# EasyEDA Pro project PCB.epro, schematic 1_P1
Board Name: 1_P1; Create Date: 2026-06-26; Page Name: 1_P1; Project Name: opencalc; Schematic Name: 1_P1; Update Date: 2026-08-03
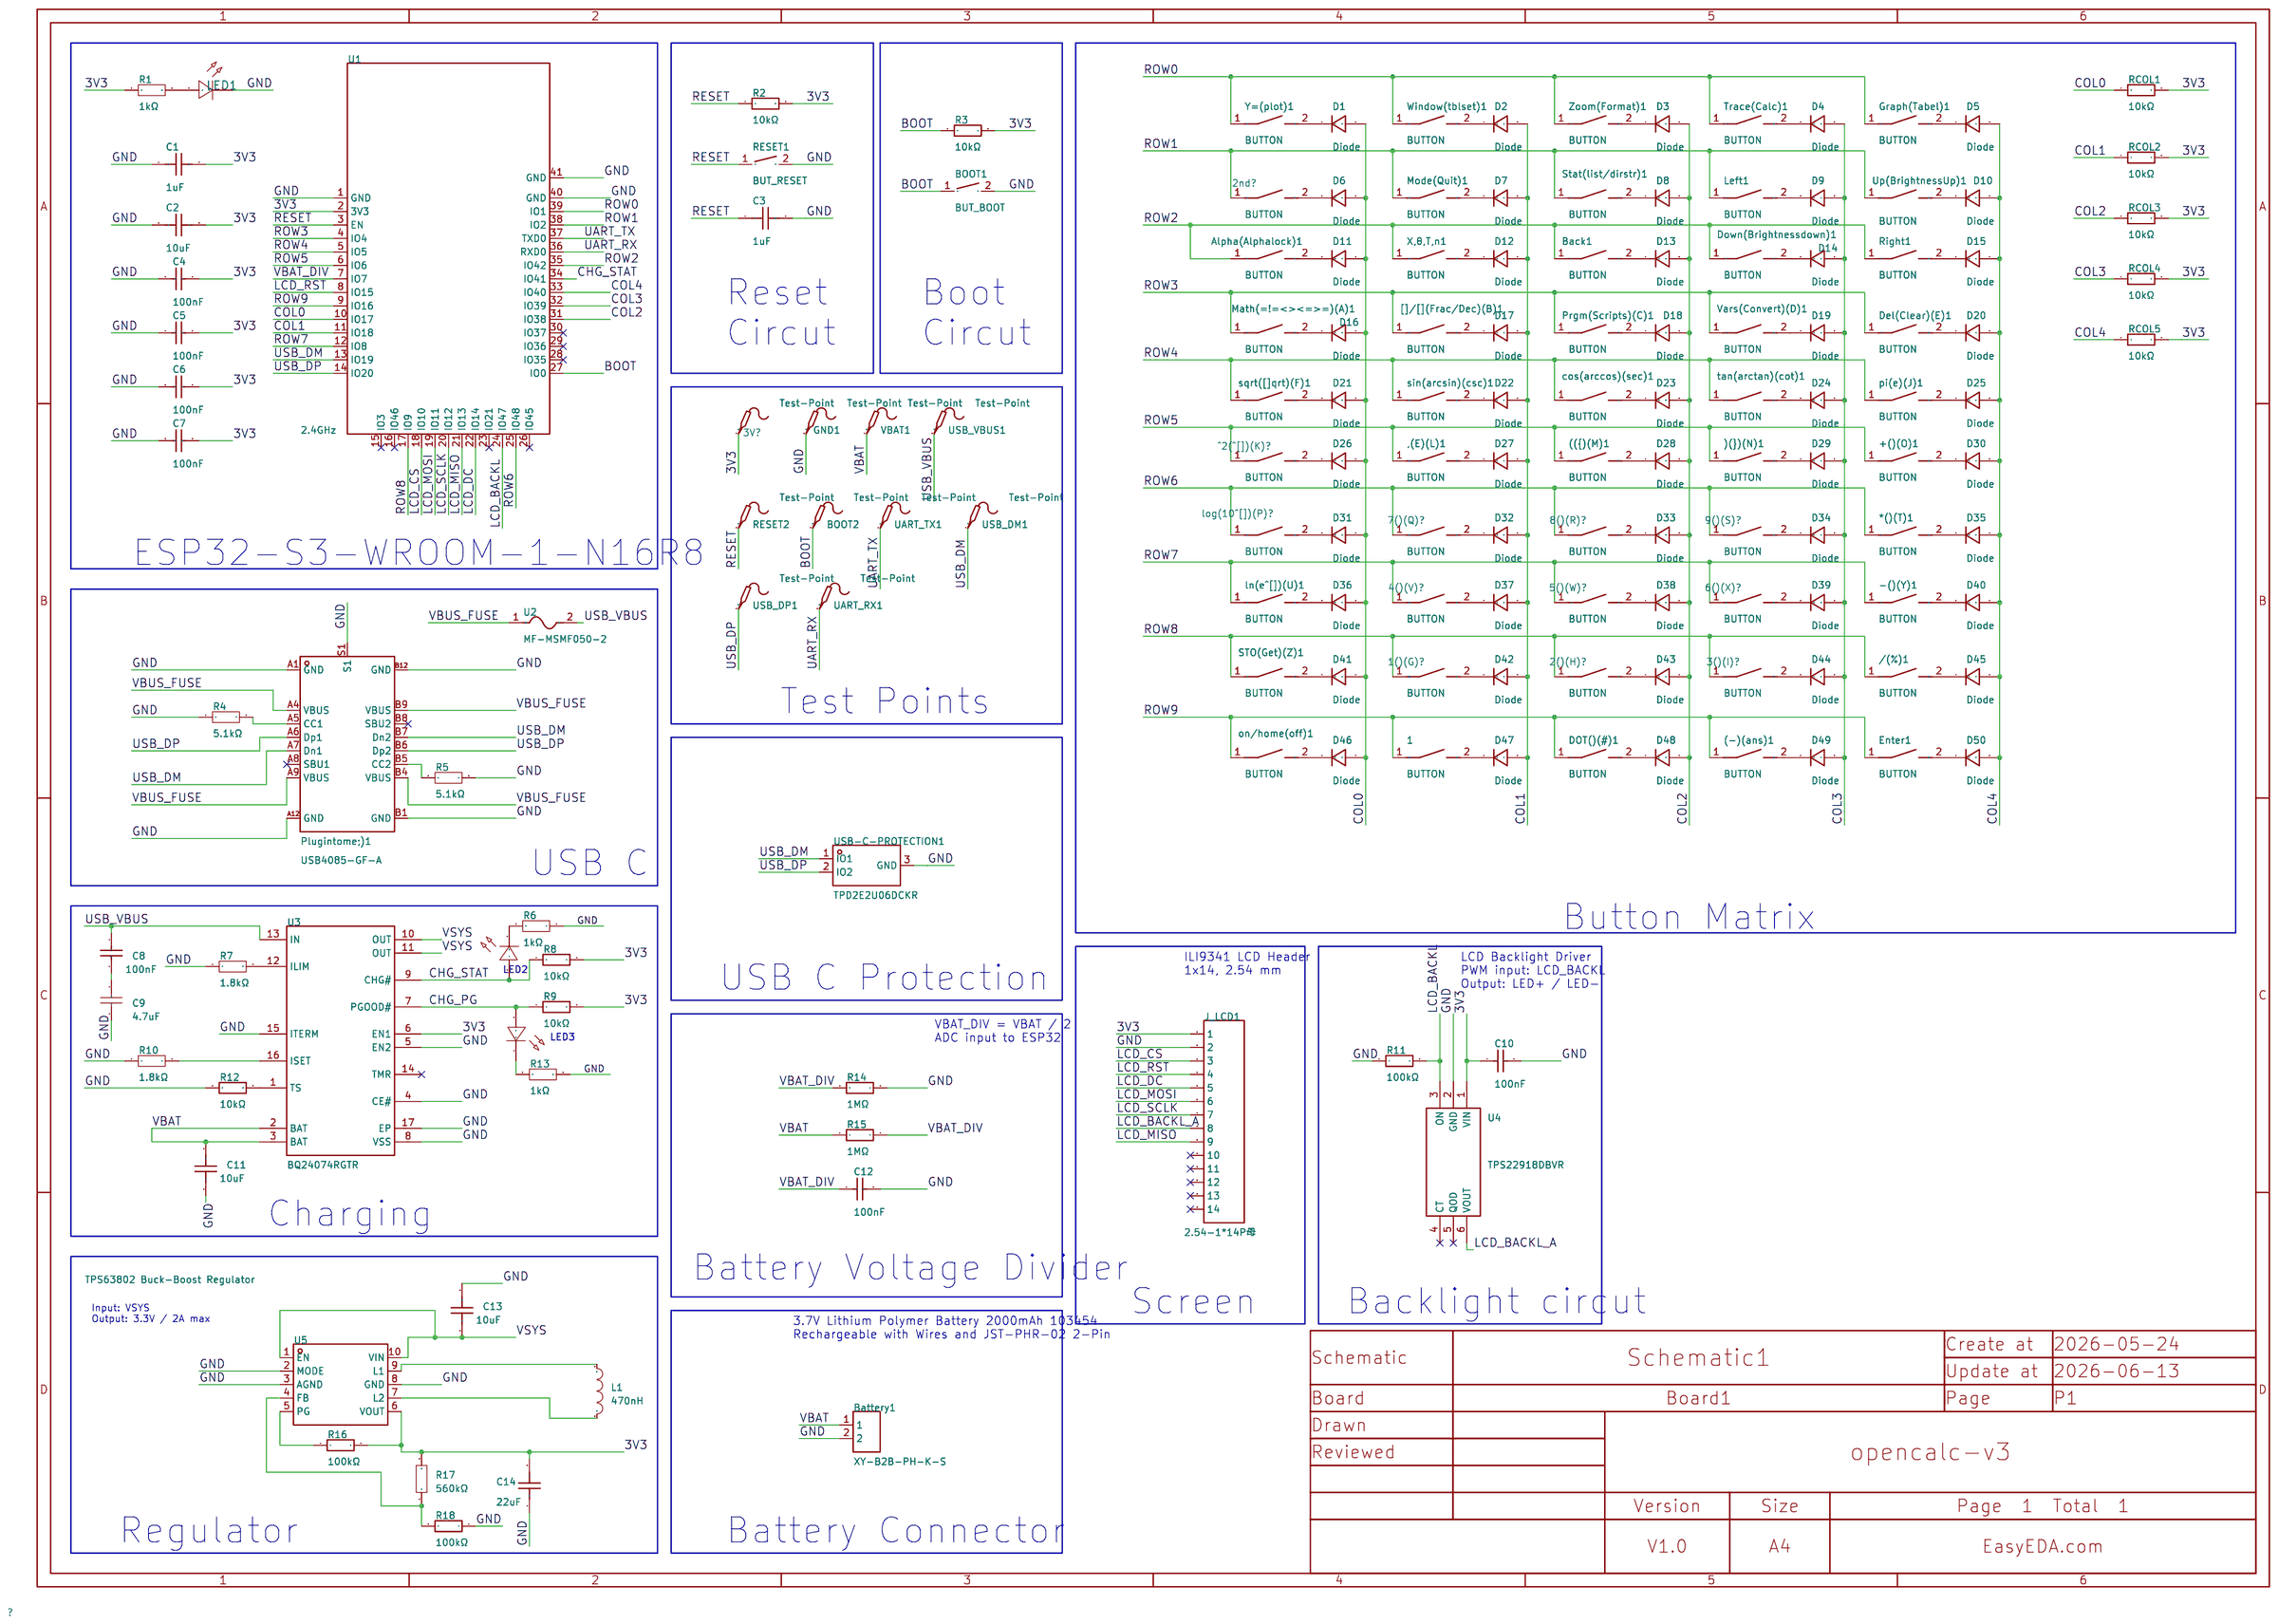
[diagram p0: schematic sheet]

## Parts
1  BUTTON  [KEY-SMD_L6.2-W3.6-LS8.0_K2-1107ST-A4SW-06]
1()(G)?#10  BUTTON  [KEY-SMD_L6.2-W3.6-LS8.0_K2-1107ST-A4SW-06]
2()(H)?#11  BUTTON  [KEY-SMD_L6.2-W3.6-LS8.0_K2-1107ST-A4SW-06]
2nd?#1  BUTTON  [KEY-SMD_L6.2-W3.6-LS8.0_K2-1107ST-A4SW-06]
3()(I)?#12  BUTTON  [KEY-SMD_L6.2-W3.6-LS8.0_K2-1107ST-A4SW-06]
3V?#13  Test-Point  [Test-Point-0.5mm]
4()(V)?#7  BUTTON  [KEY-SMD_L6.2-W3.6-LS8.0_K2-1107ST-A4SW-06]
5()(W)?#8  BUTTON  [KEY-SMD_L6.2-W3.6-LS8.0_K2-1107ST-A4SW-06]
6()(X)?#9  BUTTON  [KEY-SMD_L6.2-W3.6-LS8.0_K2-1107ST-A4SW-06]
7()(Q)?#4  BUTTON  [KEY-SMD_L6.2-W3.6-LS8.0_K2-1107ST-A4SW-06]
8()(R)?#5  BUTTON  [KEY-SMD_L6.2-W3.6-LS8.0_K2-1107ST-A4SW-06]
9()(S)?#6  BUTTON  [KEY-SMD_L6.2-W3.6-LS8.0_K2-1107ST-A4SW-06]
(({)(M)1  BUTTON  [KEY-SMD_L6.2-W3.6-LS8.0_K2-1107ST-A4SW-06]
(-)(ans)1  BUTTON  [KEY-SMD_L6.2-W3.6-LS8.0_K2-1107ST-A4SW-06]
)(})(N)1  BUTTON  [KEY-SMD_L6.2-W3.6-LS8.0_K2-1107ST-A4SW-06]
*()(T)1  BUTTON  [KEY-SMD_L6.2-W3.6-LS8.0_K2-1107ST-A4SW-06]
+()(O)1  BUTTON  [KEY-SMD_L6.2-W3.6-LS8.0_K2-1107ST-A4SW-06]
,(E)(L)1  BUTTON  [KEY-SMD_L6.2-W3.6-LS8.0_K2-1107ST-A4SW-06]
-()(Y)1  BUTTON  [KEY-SMD_L6.2-W3.6-LS8.0_K2-1107ST-A4SW-06]
/(%)1  BUTTON  [KEY-SMD_L6.2-W3.6-LS8.0_K2-1107ST-A4SW-06]
[]/[](Frac/Dec)(B)1  BUTTON  [KEY-SMD_L6.2-W3.6-LS8.0_K2-1107ST-A4SW-06]
^2(^[])(K)?#2  BUTTON  [KEY-SMD_L6.2-W3.6-LS8.0_K2-1107ST-A4SW-06]
Alpha(Alphalock)1  BUTTON  [KEY-SMD_L6.2-W3.6-LS8.0_K2-1107ST-A4SW-06]
Back1  BUTTON  [KEY-SMD_L6.2-W3.6-LS8.0_K2-1107ST-A4SW-06]
Battery1  XY-B2B-PH-K-S  [CONN-TH_B2B-PH-K-S]
BOOT1  BUT_BOOT  [KEY-SMD_L4.0-W3.0-LS4.9-1]
BOOT2  Test-Point  [Test-Point-0.5mm]
C1  1uF  [C0402]
C2  10uF  [C0805]
C3  1uF  [C0402]
C4  100nF  [C1206]
C5  100nF  [C1206]
C6  100nF  [C1206]
C7  100nF  [C1206]
C8  100nF  [C1206]
C9  4.7uF  [C0603]
C10  100nF  [C1206]
C11  10uF  [C0805]
C12  100nF  [C1206]
C13  10uF  [C0805]
C14  22uF  [C1206]
cos(arccos)(sec)1  BUTTON  [KEY-SMD_L6.2-W3.6-LS8.0_K2-1107ST-A4SW-06]
D1  Diode  [SOD-323_L1.8-W1.3-LS2.5-RD]
D2  Diode  [SOD-323_L1.8-W1.3-LS2.5-RD]
D3  Diode  [SOD-323_L1.8-W1.3-LS2.5-RD]
D4  Diode  [SOD-323_L1.8-W1.3-LS2.5-RD]
D5  Diode  [SOD-323_L1.8-W1.3-LS2.5-RD]
D6  Diode  [SOD-323_L1.8-W1.3-LS2.5-RD]
D7  Diode  [SOD-323_L1.8-W1.3-LS2.5-RD]
D8  Diode  [SOD-323_L1.8-W1.3-LS2.5-RD]
D9  Diode  [SOD-323_L1.8-W1.3-LS2.5-RD]
D10  Diode  [SOD-323_L1.8-W1.3-LS2.5-RD]
D11  Diode  [SOD-323_L1.8-W1.3-LS2.5-RD]
D12  Diode  [SOD-323_L1.8-W1.3-LS2.5-RD]
D13  Diode  [SOD-323_L1.8-W1.3-LS2.5-RD]
D14  Diode  [SOD-323_L1.8-W1.3-LS2.5-RD]
D15  Diode  [SOD-323_L1.8-W1.3-LS2.5-RD]
D16  Diode  [SOD-323_L1.8-W1.3-LS2.5-RD]
D17  Diode  [SOD-323_L1.8-W1.3-LS2.5-RD]
D18  Diode  [SOD-323_L1.8-W1.3-LS2.5-RD]
D19  Diode  [SOD-323_L1.8-W1.3-LS2.5-RD]
D20  Diode  [SOD-323_L1.8-W1.3-LS2.5-RD]
D21  Diode  [SOD-323_L1.8-W1.3-LS2.5-RD]
D22  Diode  [SOD-323_L1.8-W1.3-LS2.5-RD]
D23  Diode  [SOD-323_L1.8-W1.3-LS2.5-RD]
D24  Diode  [SOD-323_L1.8-W1.3-LS2.5-RD]
D25  Diode  [SOD-323_L1.8-W1.3-LS2.5-RD]
D26  Diode  [SOD-323_L1.8-W1.3-LS2.5-RD]
D27  Diode  [SOD-323_L1.8-W1.3-LS2.5-RD]
D28  Diode  [SOD-323_L1.8-W1.3-LS2.5-RD]
D29  Diode  [SOD-323_L1.8-W1.3-LS2.5-RD]
D30  Diode  [SOD-323_L1.8-W1.3-LS2.5-RD]
D31  Diode  [SOD-323_L1.8-W1.3-LS2.5-RD]
D32  Diode  [SOD-323_L1.8-W1.3-LS2.5-RD]
D33  Diode  [SOD-323_L1.8-W1.3-LS2.5-RD]
D34  Diode  [SOD-323_L1.8-W1.3-LS2.5-RD]
D35  Diode  [SOD-323_L1.8-W1.3-LS2.5-RD]
D36  Diode  [SOD-323_L1.8-W1.3-LS2.5-RD]
D37  Diode  [SOD-323_L1.8-W1.3-LS2.5-RD]
D38  Diode  [SOD-323_L1.8-W1.3-LS2.5-RD]
D39  Diode  [SOD-323_L1.8-W1.3-LS2.5-RD]
D40  Diode  [SOD-323_L1.8-W1.3-LS2.5-RD]
D41  Diode  [SOD-323_L1.8-W1.3-LS2.5-RD]
D42  Diode  [SOD-323_L1.8-W1.3-LS2.5-RD]
D43  Diode  [SOD-323_L1.8-W1.3-LS2.5-RD]
D44  Diode  [SOD-323_L1.8-W1.3-LS2.5-RD]
D45  Diode  [SOD-323_L1.8-W1.3-LS2.5-RD]
D46  Diode  [SOD-323_L1.8-W1.3-LS2.5-RD]
D47  Diode  [SOD-323_L1.8-W1.3-LS2.5-RD]
D48  Diode  [SOD-323_L1.8-W1.3-LS2.5-RD]
D49  Diode  [SOD-323_L1.8-W1.3-LS2.5-RD]
D50  Diode  [SOD-323_L1.8-W1.3-LS2.5-RD]
Del(Clear)(E)1  BUTTON  [KEY-SMD_L6.2-W3.6-LS8.0_K2-1107ST-A4SW-06]
DOT()(#)1  BUTTON  [KEY-SMD_L6.2-W3.6-LS8.0_K2-1107ST-A4SW-06]
Down(Brightnessdown)1  BUTTON  [KEY-SMD_L6.2-W3.6-LS8.0_K2-1107ST-A4SW-06]
Enter1  BUTTON  [KEY-SMD_L6.2-W3.6-LS8.0_K2-1107ST-A4SW-06]
GND1  Test-Point  [Test-Point-0.5mm]
Graph(Tabel)1  BUTTON  [KEY-SMD_L6.2-W3.6-LS8.0_K2-1107ST-A4SW-06]
J_LCD1  2.54-1*14P母  [HDR-TH_14P-P2.54-V-F-1]
L1  470nH  [L1008]
LED1  -  [LED_0603]
LED2  -  [LED_0603]
LED3  -  [LED_0603]
Left1  BUTTON  [KEY-SMD_L6.2-W3.6-LS8.0_K2-1107ST-A4SW-06]
ln(e^[])(U)1  BUTTON  [KEY-SMD_L6.2-W3.6-LS8.0_K2-1107ST-A4SW-06]
log(10^[])(P)?#3  BUTTON  [KEY-SMD_L6.2-W3.6-LS8.0_K2-1107ST-A4SW-06]
Math(=!=<><=>=)(A)1  BUTTON  [KEY-SMD_L6.2-W3.6-LS8.0_K2-1107ST-A4SW-06]
Mode(Quit)1  BUTTON  [KEY-SMD_L6.2-W3.6-LS8.0_K2-1107ST-A4SW-06]
on/home(off)1  BUTTON  [KEY-SMD_L6.2-W3.6-LS8.0_K2-1107ST-A4SW-06]
pi(e)(J)1  BUTTON  [KEY-SMD_L6.2-W3.6-LS8.0_K2-1107ST-A4SW-06]
Plugintome;)1  USB4085-GF-A  [USC-C-SMD_USB4085-GF-A]
Prgm(Scripts)(C)1  BUTTON  [KEY-SMD_L6.2-W3.6-LS8.0_K2-1107ST-A4SW-06]
R1  1kΩ  [R1206]
R2  10kΩ  [R0402]
R3  10kΩ  [R0402]
R4  5.1kΩ  [R0805]
R5  5.1kΩ  [R0805]
R6  1kΩ  [R1206]
R7  1.8kΩ  [R0603]
R8  10kΩ  [R0402]
R9  10kΩ  [R0402]
R10  1.8kΩ  [R0603]
R11  100kΩ  [R0402]
R12  10kΩ  [R0402]
R13  1kΩ  [R1206]
R14  1MΩ  [R0805]
R15  1MΩ  [R0805]
R16  100kΩ  [R0402]
R17  560kΩ  [R0603]
R18  100kΩ  [R0402]
RCOL1  10kΩ  [R0402]
RCOL2  10kΩ  [R0402]
RCOL3  10kΩ  [R0402]
RCOL4  10kΩ  [R0402]
RCOL5  10kΩ  [R0402]
RESET1  BUT_RESET  [KEY-SMD_L4.0-W3.0-LS4.9-1]
RESET2  Test-Point  [Test-Point-0.5mm]
Right1  BUTTON  [KEY-SMD_L6.2-W3.6-LS8.0_K2-1107ST-A4SW-06]
sin(arcsin)(csc)1  BUTTON  [KEY-SMD_L6.2-W3.6-LS8.0_K2-1107ST-A4SW-06]
sqrt([]qrt)(F)1  BUTTON  [KEY-SMD_L6.2-W3.6-LS8.0_K2-1107ST-A4SW-06]
Stat(list/dirstr)1  BUTTON  [KEY-SMD_L6.2-W3.6-LS8.0_K2-1107ST-A4SW-06]
STO(Get)(Z)1  BUTTON  [KEY-SMD_L6.2-W3.6-LS8.0_K2-1107ST-A4SW-06]
tan(arctan)(cot)1  BUTTON  [KEY-SMD_L6.2-W3.6-LS8.0_K2-1107ST-A4SW-06]
Trace(Calc)1  BUTTON  [KEY-SMD_L6.2-W3.6-LS8.0_K2-1107ST-A4SW-06]
U1  2.4GHz  [WIRELM-SMD_ESP32-S3-WROOM-1]
U2  MF-MSMF050-2  [F1812]
U3  BQ24074RGTR  [QFN-16_L3.0-W3.0-P0.50-TL-EP1.7]
U4  TPS22918DBVR  [SOT-23-6_L2.9-W1.6-P0.95-LS2.8-BR]
U5  TPS63802 Buck-Boost Regulator  [VSON-10-HR_L3.0-W2.0-P0.50-BL_TI_DLA]
UART_RX1  Test-Point  [Test-Point-0.5mm]
UART_TX1  Test-Point  [Test-Point-0.5mm]
Up(BrightnessUp)1  BUTTON  [KEY-SMD_L6.2-W3.6-LS8.0_K2-1107ST-A4SW-06]
USB-C-PROTECTION1  TPD2E2U06DCKR  [SC-70-3_L2.0-W1.3-P0.65-LS2.1-BL]
USB_DM1  Test-Point  [Test-Point-0.5mm]
USB_DP1  Test-Point  [Test-Point-0.5mm]
USB_VBUS1  Test-Point  [Test-Point-0.5mm]
Vars(Convert)(D)1  BUTTON  [KEY-SMD_L6.2-W3.6-LS8.0_K2-1107ST-A4SW-06]
VBAT1  Test-Point  [Test-Point-0.5mm]
Window(tblset)1  BUTTON  [KEY-SMD_L6.2-W3.6-LS8.0_K2-1107ST-A4SW-06]
X,θ,T,n1  BUTTON  [KEY-SMD_L6.2-W3.6-LS8.0_K2-1107ST-A4SW-06]
Y=(plot)1  BUTTON  [KEY-SMD_L6.2-W3.6-LS8.0_K2-1107ST-A4SW-06]
Zoom(Format)1  BUTTON  [KEY-SMD_L6.2-W3.6-LS8.0_K2-1107ST-A4SW-06]

## Library data of the parts
1 1()(G)?#10 2()(H)?#11 2nd?#1 3()(I)?#12 4()(V)?#7 5()(W)?#8 6()(X)?#9 7()(Q)?#4 8()(R)?#5 9()(S)?#6 (({)(M)1 (-)(ans)1 )(})(N)1 *()(T)1 +()(O)1 ,(E)(L)1 -()(Y)1 /(%)1 []/[](Frac/Dec)(B)1 ^2(^[])(K)?#2 Alpha(Alphalock)1 Back1 cos(arccos)(sec)1 Del(Clear)(E)1 DOT()(#)1 Down(Brightnessdown)1 Enter1 Graph(Tabel)1 Left1 ln(e^[])(U)1 log(10^[])(P)?#3 Math(=!=<><=>=)(A)1 Mode(Quit)1 on/home(off)1 pi(e)(J)1 Prgm(Scripts)(C)1 Right1 sin(arcsin)(csc)1 sqrt([]qrt)(F)1 Stat(list/dirstr)1 STO(Get)(Z)1 tan(arctan)(cot)1 Trace(Calc)1 Up(BrightnessUp)1 Vars(Convert)(D)1 Window(tblset)1 X,θ,T,n1 Y=(plot)1 Zoom(Format)1 = K2-1107ST-A4DW-06: LCSC Part Name: 轻触开关 3.6*6.1*2.5; Supplier Part: C118141; Manufacturer: 韩国韩荣; Supplier Footprint: SMD,6.1x3.6mm; JLCPCB Part Class: Extended Part; Supplier: LCSC; Circuit: SPST; Actuator Style: Rectangular Button; Operating Force: 2.5N; Mounting Type: Surface Mount,Vertical; Length: 6.1mm; Width: 3.6mm; Switch Height: 2.5mm; Contact Current: 50mA; Voltage Rating: 12V; Life: 100,000 Cycles; Operating Temperature: -25℃~+85℃
3V?#13 BOOT2 GND1 RESET2 UART_RX1 UART_TX1 USB_DM1 USB_DP1 USB_VBUS1 VBAT1 = Test-Point
Battery1 = XY-B2B-PH-K-S: LCSC Part Name: 1x2P 间距:2mm; Supplier Part: C51940125; Manufacturer: XYECONN(辛译); Supplier Footprint: 插件,P=2mm; JLCPCB Part Class: Extended Part; Supplier: LCSC; Pins Structure: 1x2P; Pitch: 2mm; Number of Pins: 2P; Number of Rows: 1; Number of PINs Per Row: 2; Current Rating: 2A; Contact Material: Brass; Contact Plating: Tin; Operating Temperature: -25℃~+85℃; Voltage Rating: 250V; Plastic Material: PA66; Flame Retardant Rating: UL94V-0; Color: White
BOOT1 RESET1 = HX 3x4x2-2P-1.6N TACTILE SWITCH: LCSC Part Name: 4*3*2mm 立贴 轻触开关; Supplier Part: C49234124; Manufacturer: hanxia(韩下); Supplier Footprint: SMD; JLCPCB Part Class: Extended Part; Datasheet: https://item.szlcsc.com/datasheet/HX%25203x4x2-2P-1.6N%2520TACTILE%2520SWITCH/51650185.html; Supplier: LCSC; Circuit: SPST; Actuator Style: Round Button; Operating Force: 1.6N; Mounting Type: Surface Mount,Vertical; Length: 4mm; Width: 3mm; Switch Height: 2mm; with Bracket: Without Bracket; Contact Current: 50mA; Voltage Rating: 12V; Actuator/Cap Color: Black; With Lamp: No; Termination Style: SMD(SMT) Tab; Life: 100,000 Cycles
C1 C3 = C0402B105K016T: LCSC Part Name: 1uF ±10% 16V; Supplier Part: C340321; Manufacturer: IHHEC(禾伸堂); Supplier Footprint: 0402; JLCPCB Part Class: Extended Part; Datasheet: https://atta.szlcsc.com/upload/public/pdf/source/20190313/C374174_331C86E4A68CC9C732DA87186AAF7F8A.pdf; Supplier: LCSC; Tolerance: ±10%
C2 C11 C13 = GRM21BR61H106KE43L: LCSC Part Name: 10uF ±10% 50V; Supplier Part: C440198; Manufacturer: muRata(村田); Supplier Footprint: 0805; JLCPCB Part Class: Basic Part; Datasheet: https://item.szlcsc.com/datasheet/GRM21BR61H106KE43L/439567.html; Supplier: LCSC; Tolerance: ±10%; Voltage Rating: 50V; Temperature Coefficient: X5R
C4-C8 C10 C12 = CL31B104KBCNNNC: Supplier: LCSC; Manufacturer: SAMSUNG(三星); Supplier Part: C24497; JLCPCB Part Class: Basic Part; LCSC Part Name: 100nF ±10% 50V; Supplier Footprint: 1206; Datasheet: https://item.szlcsc.com/datasheet/CL31B104KBCNNNC/25237.html; Tolerance: ±10%; Voltage Rating: 50V; Temperature Coefficient: X7R
C9 = 0603B475K100NT: Capacitance: Tolerance: Tolerance: Voltage Rated: Temperature Coefficient:; LCSC Part Name: 4.7uF ±10% 10V; Supplier Part: C108342; Manufacturer: FH(风华); Supplier Footprint: 0603; JLCPCB Part Class: Extended Part; Datasheet: https://atta.szlcsc.com/upload/public/pdf/source/20171212/C108342_15130634122111177507.pdf; Supplier: LCSC
C14 = HGC1206R7226M160NSPJ: LCSC Part Name: 22uF ±20% 16V; Supplier Part: C7432788; Manufacturer: Chinocera(华瓷); Supplier Footprint: 1206; JLCPCB Part Class: Extended Part; Datasheet: https://item.szlcsc.com/datasheet/HGC1206R7226M160NSPJ/8438270.html; Supplier: LCSC; Tolerance: ±20%; Voltage Rating: 16V; Temperature Coefficient: X7R
D1-D50 = 1N4148WSQ-7-F: Supplier Part: C176908; Manufacturer: DIODES(美台); Supplier Footprint: SOD-323; JLCPCB Part Class: Extended Part; Datasheet: https://item.szlcsc.com/datasheet/1N4148WSQ-7-F/188299.html; Supplier: LCSC; Diode Configuration: Independent; Voltage - Forward(Vf@If): 1.25V@150mA; Voltage - DC Reverse(Vr): 75V; Current - Rectified: 150mA; Pd - Power Dissipation: 200mW; Reverse Leakage Current (Ir): 1uA@75V; Reverse Recovery Time (trr): 4ns; Operating Junction Temperature Range: -65℃~+150℃@(Tj); Non-Repetitive Peak Forward Surge Current: 2A
J_LCD1 = 2.54-1*14P母: LCSC Part Name: 1x14P 间距:2.54mm 直插; Supplier Part: C52711; Manufacturer: BOOMELE(博穆精密); Supplier Footprint: 插件,P=2.54mm; JLCPCB Part Class: Extended Part; Datasheet: https://item.szlcsc.com/datasheet/2.54-1*14P%25E6%25AF%258D/53725.html; Supplier: LCSC; Holes Structure: 1x14P; Pitch: 2.54mm; Circular Hole / Square Hole: Square Hole; Mounting Type: Through Hole; Number of Rows: 1; Number of Positions: 14P; Current Rating: 3A; Holes Direction: Top; Contact Material: Brass; Operating Temperature: -40℃~+105℃; PIN Length: 3.3mm
L1 = DFE252012P-R47M=P2: Inductance: Tolerance: Tolerance: Rated Current: DC Resistance (DCR):; LCSC Part Name: 470nH ±20% 4A 27mΩ; Supplier Part: C237552; Manufacturer: muRata(村田); Supplier Footprint: 1008; JLCPCB Part Class: Extended Part; Datasheet: https://atta.szlcsc.com/upload/public/pdf/source/20181115/C237552_128D618284655539567B1DADCA21E97C.pdf; Supplier: LCSC
LED1 = LED_0603-R: Supplier Footprint: 0603
LED2 = LED_0603-G: Supplier Footprint: 0603
LED3 = LED_0603-B: Supplier Footprint: 0603
Plugintome;)1 = USB4085-GF-A_C7095263: LCSC Part Name: Type-C 母 弯插; Supplier Part: C7095263; Manufacturer: GCT; Supplier Footprint: 插件; JLCPCB Part Class: Extended Part; Datasheet: https://item.szlcsc.com/datasheet/USB4085-GF-A/8061907.html; Supplier: LCSC; Connector Type: Type-C; Protocol Standard: USB 2.0; Gender: Female; Mounting Type: Right Angle; Number of Ports: 1; Current Rating-Power: 5A; Voltage Rating: 48V; Detection color: Black; Operating Temperature: -40℃~+85℃
R1 R6 R13 = RC1206JR-071KL: Operating Temperature Range: Operating Temperature Range: Power(Watts):250mW Body Length:- Tolerance: φD:- Body Height:- Body Width:- Type:Thick Film Resistors Temperature Coefficient: Temperature Coefficient: Resistance: Overload Voltage (Max):; LCSC Part Name: 1kΩ ±5%; Supplier Part: C112223; Manufacturer: YAGEO(国巨); Supplier Footprint: 1206; JLCPCB Part Class: Extended Part; Datasheet: https://atta.szlcsc.com/upload/public/pdf/source/20170912/C112223_1505207744277963372.pdf; Supplier: LCSC; Power(Watts): 250mW; Type: Thick Film Resistors
R2 R3 R8 R9 R12 RCOL1-RCOL5 = 0402WGF1002TCE: LCSC Part Name: 10kΩ ±1% 62.5mW 厚膜电阻; Supplier Part: C25744; Manufacturer: UNI-ROYAL(厚声); Supplier Footprint: 0402; JLCPCB Part Class: Basic Part; Datasheet: https://item.szlcsc.com/datasheet/0402WGF1002TCE/26487.html; Supplier: LCSC; Type: Thick Film Resistor; Tolerance: ±1%; Power(Watts): 62.5mW; Voltage-Supply(Max): 50V; Temperature Coefficient: ±100ppm/℃; Operating Temperature: -55℃~+155℃
R4 R5 = RMC08055.1K1%N: Resistance: Tolerance:±1% Tolerance:±1% Power(Watts):; LCSC Part Name: 5.1kΩ ±1% 125mW; Supplier Part: C269748; Manufacturer: Tyohm(幸亚电阻); Supplier Footprint: 0805; JLCPCB Part Class: Extended Part; Datasheet: https://atta.szlcsc.com/upload/public/pdf/source/20190115/C269748_2A47D41A540BF52C6BA23B334851AB58.pdf; Supplier: LCSC; Tolerance: ±1%
R7 R10 = WR06X1801FTL: Resistance: Tolerance:±1% Tolerance:±1% Power(Watts): Temperature Coefficient:±100ppm/℃ Temperature Coefficient:±100ppm/℃ Overload Voltage (Max): Operating Temperature Range:-55℃~+155℃ Operating Temperature Range:-55℃~+155℃; LCSC Part Name: 1.8kΩ ±1% 100mW; Supplier Part: C163841; Manufacturer: Walsin(华新科); Supplier Footprint: 0603; JLCPCB Part Class: Extended Part; Datasheet: https://atta.szlcsc.com/upload/public/pdf/source/20180228/C163841_15198053489591377215.pdf; Supplier: LCSC; Tolerance: ±1%; Temperature Coefficient: ±100ppm/℃; Operating Temperature Range: -55℃~+155℃
R11 R16 R18 = 0402WGF1003TCE: Supplier: LCSC; Manufacturer: UNI-ROYAL(厚声); Supplier Part: C25741; JLCPCB Part Class: Basic Part; LCSC Part Name: 100kΩ ±1% 62.5mW 厚膜电阻; Supplier Footprint: 0402; Datasheet: https://item.szlcsc.com/datasheet/0402WGF1003TCE/26484.html; Type: Thick Film Resistor; Tolerance: ±1%; Power(Watts): 62.5mW; Voltage-Supply(Max): 50V; Temperature Coefficient: ±100ppm/℃; Operating Temperature: -55℃~+155℃
R14 R15 = 0805W8F1004T5E: Supplier: LCSC; Manufacturer: UNI-ROYAL(厚声); Supplier Part: C17514; JLCPCB Part Class: Basic Part; LCSC Part Name: 1MΩ ±1% 125mW 厚膜电阻; Supplier Footprint: 0805; Datasheet: https://atta.szlcsc.com/upload/public/pdf/source/20200306/C422600_1E6D84923E4A46A82E41ADD87F860B5C.pdf; Type: Thick Film Resistors; Tolerance: ±1%; Temperature Coefficient: ±100ppm/℃; Operating Temperature Range: -55℃~+155℃
R17 = RC0603FR-07560KL: Overload Voltage (Max): Operating Temperature Range: Operating Temperature Range: Body Length:- Tolerance: φD:- Body Height:- Body Width:- Type:Thick Film Resistors Resistance: Temperature Coefficient: Temperature Coefficient: Power(Watts):; LCSC Part Name: 560kΩ ±1%; Supplier Part: C137699; Manufacturer: YAGEO(国巨); Supplier Footprint: 0603; JLCPCB Part Class: Extended Part; Datasheet: https://atta.szlcsc.com/upload/public/pdf/source/20171106/C137699_15099606113521093845.pdf; Supplier: LCSC; Type: Thick Film Resistors
U1 = ESP32-S3-WROOM-1-N16R8: LCSC Part Name: 不带固件 通用型Wi-Fi+低功耗蓝牙MCU模组; Supplier Part: C2913202; Manufacturer: ESPRESSIF(乐鑫); Supplier Footprint: SMD,25.5x18mm; JLCPCB Part Class: Extended Part; Datasheet: https://item.szlcsc.com/datasheet/ESP32-S3-WROOM-1-N16R8/3198300.html; Supplier: LCSC; Utilized IC / Part: ESP32-S3R8; Interface Type: I2C；GPIO；UART；SPI；USB；I2S; Antenna Type: On-board PCB Antenna; Output Power: 20.5dBm; Voltage - Supply: 3V~3.6V; Receive  Current: 95mA; Send  Current: 355mA; Sensitivity: -103.5dBm; Operating Temperature: -40℃~+65℃
U2 = MF-MSMF050-2: LCSC Part Name: 15V 500mA 1812自恢复; Supplier Part: C17313; Manufacturer: BOURNS; Supplier Footprint: 1812; JLCPCB Part Class: Extended Part; Datasheet: https://item.szlcsc.com/datasheet/MF-MSMF050-2/17998.html; Supplier: LCSC; Voltage - Max: 15V; Current - Max: 100A; Hold Current: 500mA; Trip Current: 1A; Resistance - Initial (Ri) (Min): 150mΩ; Resistance - Post Trip (R1) (Max): 1Ω; Operating Temperature: -40℃~+85℃; Length: 5.4mm; Width: 3.2mm
U3 = BQ24074RGTR: LCSC Part Name: 1.5A USB友好型锂离子电池充电器和电源路径管理IC; Supplier Part: C54313; Manufacturer: TI(德州仪器); Supplier Footprint: QFN-16-EP(3x3); JLCPCB Part Class: Extended Part; Datasheet: https://www.ti.com/cn/lit/gpn/bq24074; Supplier: LCSC; The Chip Type: Charging IC; Voltage - Supply: 4.35V~10.2V; Charge Current - Max: 1.5A; Charging Saturation Voltage: 4.2V; Type of Battery: Lithium Battery; Number of Cells: 1; Operating Temperature: -40℃~+125℃; Battery Temperature Detection: Support; 0V Battery Charge: Not supported; Supply Current (Iq): 6.5uA
U4 = TPS22918DBVR: LCSC Part Name: 5.5V、2A、导通电阻的负载开关; Supplier Part: C131941; Manufacturer: TI(德州仪器); Supplier Footprint: SOT-23-6; JLCPCB Part Class: Extended Part; Datasheet: https://www.ti.com/cn/lit/gpn/tps22918; Supplier: LCSC; Type: Load Switch; Number of Channels: 1; Control Input Logic: Active High; Voltage - Supply: 1V~5.5V; Maximum Continuous Current: 2A; RDS(on): 53mΩ; Features: Integrated charge pump；Output discharge function；Soft-start; Operating Temperature	-: -40℃~+105℃
U5 = TPS63802DLAT: Supplier: LCSC; Supplier Part: C1849531; Manufacturer: TI(德州仪器); Manufacturer Part: TPS63801 Buck-Boost Regulatornput: VSYSutput: 3.3V / 2A max; JLCPCB Part Class: Extended Part; Supplier Footprint: VSON-10(2x3); Datasheet: https://www.ti.com/cn/lit/gpn/tps63802; Function: Boost type; Output Type: Adjustable; Voltage - Supply: 1.3V~5.5V; Output Voltage: 1.8V~5.2V; Output Current: 2A; Frequency - Switching: 2.1MHz; Operating Temperature: -40℃~+125℃@(TJ); Synchronous Rectifier: Yes; Number of Outputs: 1; Topology: Step-down-Boost; Switch tube (built-in/external): Built-in
USB-C-PROTECTION1 = TPD2E2U06DCKR: Supplier Part: C1855726; Manufacturer: TI(德州仪器); Supplier Footprint: SC-70-3; JLCPCB Part Class: Extended Part; Datasheet: https://www.ti.com/cn/lit/gpn/tpd2e2u06; Supplier: LCSC; Reverse Stand-Off Voltage (Vrwm): 5.5V; Maximum Clamping Voltage: 12.4V; Peak Pulse Current (Ipp): 5.5A@8/20us; Peak Pulse Power Dissipation (Ppp): 75W; Breakdown Voltage: 6.5V; Number of Lines: Dual channel; Operating Temperature: -40℃~+125℃@(Ta); Type: ESD

## Nets
3V3: 3V?#13.1 C1.2 C2.2 C4.2 C5.2 C6.2 C7.2 C10.1 C14.2 J_LCD1.1 R1.1 R2.2 R3.2 R8.2 R9.2 R16.2 R17.2 RCOL1.2 RCOL2.2 RCOL3.2 RCOL4.2 RCOL5.2 U1.2(3V3) U3.6(EN1) U4.1(VIN) U5.6(VOUT)
GND: Battery1.2 BOOT1.2 C1.1 C2.1 C3.2 C4.1 C5.1 C6.1 C7.1 C9.2 C10.2 C11.2 C12.2 C13.2 C14.1 GND1.1 J_LCD1.2 LED1.1(C) Plugintome;)1.A1(GND) Plugintome;)1.A12(GND) Plugintome;)1.B1(GND) Plugintome;)1.B12(GND) Plugintome;)1.S1 R4.1 R5.2 R6.1 R7.1 R10.1 R11.1 R12.1 R13.1 R14.2 R18.1 RESET1.2 U1.1(GND) U1.40(GND) U1.41(GND) U3.4(CE#) U3.5(EN2) U3.8(VSS) U3.15(ITERM) U3.17(EP) U4.2(GND) U5.2(MODE) U5.3(AGND) U5.8(GND) USB-C-PROTECTION1.3(GND)
VBAT: Battery1.1 C11.1 R15.1 U3.2(BAT) U3.3(BAT) VBAT1.1
VBAT_DIV: C12.1 R14.1 R15.2 U1.7(IO7)
VBUS_FUSE: Plugintome;)1.A4(VBUS) Plugintome;)1.A9(VBUS) Plugintome;)1.B4(VBUS) Plugintome;)1.B9(VBUS) U2.1
BOOT: BOOT1.1 BOOT2.1 R3.1 U1.27(IO0)
CHG_PG: LED3.2(A) R9.1 U3.7(PGOOD#)
CHG_STAT: LED2.2(A) R8.1 U1.34(IO41) U3.9(CHG#)
COL0: D1.2 D6.2 D11.2 D16.2 D21.2 D26.2 D31.2 D36.2 D41.2 D46.2 RCOL1.1 U1.10(IO17)
COL1: D2.2 D7.2 D12.2 D17.2 D22.2 D27.2 D32.2 D37.2 D42.2 D47.2 RCOL2.1 U1.11(IO18)
COL2: D3.2 D8.2 D13.2 D18.2 D23.2 D28.2 D33.2 D38.2 D43.2 D48.2 RCOL3.1 U1.31(IO38)
COL3: D4.2 D9.2 D14.2 D19.2 D24.2 D29.2 D34.2 D39.2 D44.2 D49.2 RCOL4.1 U1.32(IO39)
COL4: D5.2 D10.2 D15.2 D20.2 D25.2 D30.2 D35.2 D40.2 D45.2 D50.2 RCOL5.1 U1.33(IO40)
LCD_BACKL: R11.2 U1.24(IO47) U4.3(ON)
LCD_BACKL_A: J_LCD1.8 U4.6(VOUT)
LCD_CS: J_LCD1.3 U1.18(IO10)
LCD_DC: J_LCD1.5 U1.22(IO14)
LCD_MISO: J_LCD1.9 U1.21(IO13)
LCD_MOSI: J_LCD1.6 U1.19(IO11)
LCD_RST: J_LCD1.4 U1.8(IO15)
LCD_SCLK: J_LCD1.7 U1.20(IO12)
RESET: C3.1 R2.1 RESET1.1 RESET2.1 U1.3(EN)
ROW0: Graph(Tabel)1.1 Trace(Calc)1.1 U1.39(IO1) Window(tblset)1.1 Y=(plot)1.1 Zoom(Format)1.1
ROW1: 2nd?#1.1 Left1.1 Mode(Quit)1.1 Stat(list/dirstr)1.1 U1.38(IO2) Up(BrightnessUp)1.1
ROW2: Alpha(Alphalock)1.1 Back1.1 Down(Brightnessdown)1.1 Right1.1 U1.35(IO42) X,θ,T,n1.1
ROW3: []/[](Frac/Dec)(B)1.1 Del(Clear)(E)1.1 Math(=!=<><=>=)(A)1.1 Prgm(Scripts)(C)1.1 U1.4(IO4) Vars(Convert)(D)1.1
ROW4: cos(arccos)(sec)1.1 pi(e)(J)1.1 sin(arcsin)(csc)1.1 sqrt([]qrt)(F)1.1 tan(arctan)(cot)1.1 U1.5(IO5)
ROW5: (({)(M)1.1 )(})(N)1.1 +()(O)1.1 ,(E)(L)1.1 ^2(^[])(K)?#2.1 U1.6(IO6)
ROW6: 7()(Q)?#4.1 8()(R)?#5.1 9()(S)?#6.1 *()(T)1.1 log(10^[])(P)?#3.1 U1.25(IO48)
ROW7: 4()(V)?#7.1 5()(W)?#8.1 6()(X)?#9.1 -()(Y)1.1 ln(e^[])(U)1.1 U1.12(IO8)
ROW8: 1()(G)?#10.1 2()(H)?#11.1 3()(I)?#12.1 /(%)1.1 STO(Get)(Z)1.1 U1.17(IO9)
ROW9: 1.1 (-)(ans)1.1 DOT()(#)1.1 Enter1.1 on/home(off)1.1 U1.9(IO16)
UART_RX: U1.36(RXD0) UART_RX1.1
UART_TX: U1.37(TXD0) UART_TX1.1
USB_DM: Plugintome;)1.A7(Dn1) Plugintome;)1.B7(Dn2) U1.13(IO19) USB-C-PROTECTION1.1(IO1) USB_DM1.1
USB_DP: Plugintome;)1.A6(Dp1) Plugintome;)1.B6(Dp2) U1.14(IO20) USB-C-PROTECTION1.2(IO2) USB_DP1.1
USB_VBUS: C8.1 U2.2 U3.13(IN) USB_VBUS1.1
VSYS: C13.1 U3.10(OUT) U3.11(OUT) U5.1(EN) U5.10(VIN)
$1N84: Plugintome;)1.A5(CC1) R4.2
$1N85: Plugintome;)1.B5(CC2) R5.1
$1N102: R10.2 U3.16(ISET)
$1N159: L1.2 U5.7(L2)
$1N168: R16.1 U5.5(PG)
$1N192: D1.1 Y=(plot)1.2
$1N193: D2.1 Window(tblset)1.2
$1N194: D3.1 Zoom(Format)1.2
$1N195: D4.1 Trace(Calc)1.2
$1N196: D5.1 Graph(Tabel)1.2
$1N197: D10.1 Up(BrightnessUp)1.2
$1N198: D9.1 Left1.2
$1N199: D8.1 Stat(list/dirstr)1.2
$1N200: D7.1 Mode(Quit)1.2
$1N202: Alpha(Alphalock)1.2 D11.1
$1N203: D12.1 X,θ,T,n1.2
$1N204: Back1.2 D13.1
$1N205: D14.1 Down(Brightnessdown)1.2
$1N206: D15.1 Right1.2
$1N207: D20.1 Del(Clear)(E)1.2
$1N208: D19.1 Vars(Convert)(D)1.2
$1N209: D18.1 Prgm(Scripts)(C)1.2
$1N210: []/[](Frac/Dec)(B)1.2 D17.1
$1N211: D16.1 Math(=!=<><=>=)(A)1.2
$1N212: D21.1 sqrt([]qrt)(F)1.2
$1N213: D22.1 sin(arcsin)(csc)1.2
$1N214: cos(arccos)(sec)1.2 D23.1
$1N215: D24.1 tan(arctan)(cot)1.2
$1N216: D25.1 pi(e)(J)1.2
$1N217: +()(O)1.2 D30.1
$1N218: )(})(N)1.2 D29.1
$1N219: (({)(M)1.2 D28.1
$1N220: ,(E)(L)1.2 D27.1
$1N226: *()(T)1.2 D35.1
$1N227: -()(Y)1.2 D40.1
$1N231: D36.1 ln(e^[])(U)1.2
$1N232: D41.1 STO(Get)(Z)1.2
$1N236: /(%)1.2 D45.1
$1N237: D50.1 Enter1.2
$1N238: (-)(ans)1.2 D49.1
$1N239: D48.1 DOT()(#)1.2
$1N240: 1.2 D47.1
$1N241: D46.1 on/home(off)1.2
$1N22667: R7.2 U3.12(ILIM)
$1N22775: C8.2 C9.1
$1N23153: LED1.2(A) R1.2
$1N23280: LED2.1(C) R6.2
$1N28035: LED3.1(C) R13.2
$1N28086: R12.2 U3.1(TS)
$1N37419: L1.1 U5.9(L1)
$1N37590: R17.1 R18.2 U5.4(FB)
Net-(1()(G)?#10-2): 1()(G)?#10.2 D42.1
Net-(2()(H)?#11-2): 2()(H)?#11.2 D43.1
Net-(2nd?#1-2): 2nd?#1.2 D6.1
Net-(3()(I)?#12-2): 3()(I)?#12.2 D44.1
Net-(4()(V)?#7-2): 4()(V)?#7.2 D37.1
Net-(5()(W)?#8-2): 5()(W)?#8.2 D38.1
Net-(6()(X)?#9-2): 6()(X)?#9.2 D39.1
Net-(7()(Q)?#4-2): 7()(Q)?#4.2 D32.1
Net-(8()(R)?#5-2): 8()(R)?#5.2 D33.1
Net-(9()(S)?#6-2): 9()(S)?#6.2 D34.1
Net-(^2(^[])(K)?#2-2): ^2(^[])(K)?#2.2 D26.1
Net-(D31-1): D31.1 log(10^[])(P)?#3.2

Not connected (* = marked no-connect by the designer): J_LCD1 10* 11* 12* 13* 14*; Plugintome;)1 A8(SBU1)* B8(SBU2)*; U1 15(IO3)* 16(IO46)* 23(IO21)* 26(IO45)* 28(IO35)* 29(IO36)* 30(IO37)*; U3 14(TMR)*; U4 4(CT)* 5(QOD)*

## Notes on the sheet
- Reset
  Circut
- Boot
  Circut
- ESP32-S3-WROOM-1-N16R8
- Test Points
- USB C
- Button Matrix
- ILI9341 LCD Header
  1x14, 2.54 mm
- LCD Backlight Driver
  PWM input: LCD_BACKL
  Output: LED+ / LED-
- USB C Protection
- VBAT_DIV = VBAT / 2
  ADC input to ESP32
- Charging
- Battery Voltage Divider
- 3.7V Lithium Polymer Battery 2000mAh 103454
  Rechargeable with Wires and JST-PHR-02 2-Pin
- Screen
- Backlight circut
- Input: VSYS
  Output: 3.3V / 2A max
- Regulator
- Battery Connector
